# EAGLE schematic mehhhh (EAGLE 6.1)
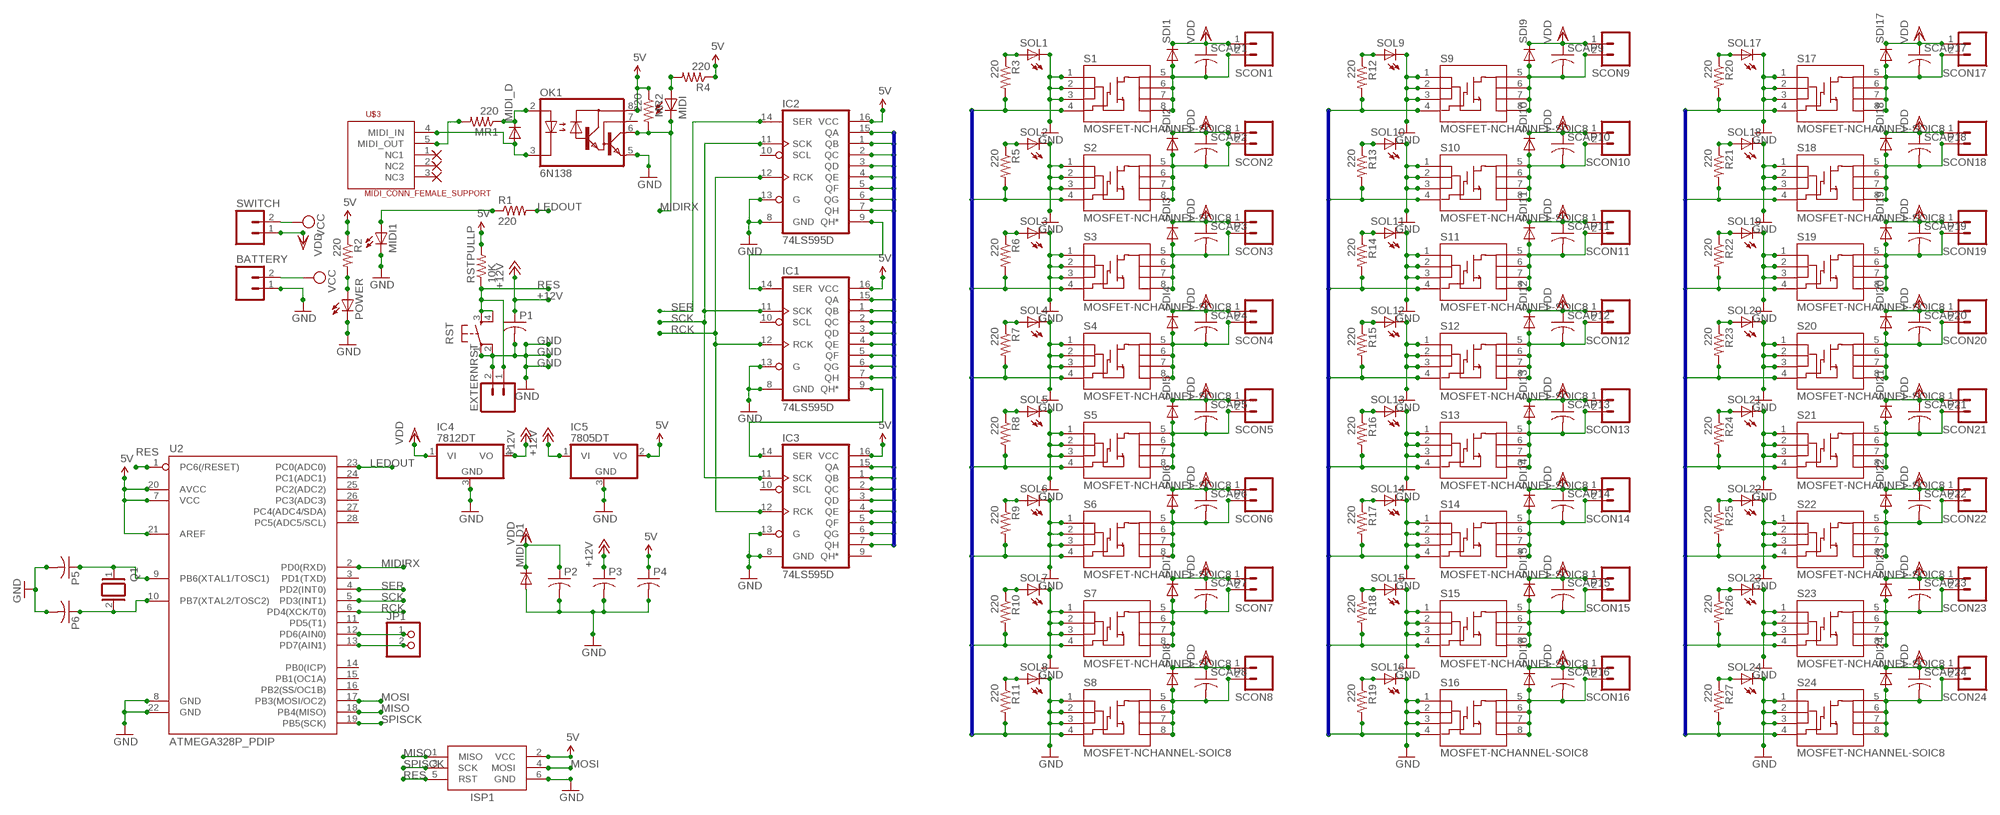
[diagram p0: schematic, sheet 1]

## Parts
BATTERY  M023.5MM  [SCREWTERMINAL-3.5MM-2]
EXTERNRST  M023.5MM  [SCREWTERMINAL-3.5MM-2]
IC1  74LS595D  [SO16]
IC2  74LS595D  [SO16]
IC3  74LS595D  [SO16]
IC4  7812DT  [TO252]
IC5  7805DT  [TO252]
ISP1  AVRISP-6  [AVRISP]
JP1  PINHD-1X2  [1X02]
MIDI  LEDCHIPLED_1206  [CHIPLED_1206]
MIDI1  LEDCHIPLED_1206  [CHIPLED_1206]
MIDI_D  DIODESMA-ALT  [SMA-DIODE_ALT]
MIDI_D1  DIODESMA-ALT  [SMA-DIODE_ALT]
MR1  220  RESISTOR1206  [1206]
MR2  220  RESISTOR1206  [1206]
OK1  6N138  [DIL08]
P1  C-USC1206  [C1206]
P2  C-USC1206  [C1206]
P3  C-USC1206  [C1206]
P4  C-USC1206  [C1206]
P5  C-USC1206  [C1206]
P6  C-USC1206  [C1206]
POWER  LEDCHIPLED_1206  [CHIPLED_1206]
Q1  XTAL/S  [QS]
R1  220  RESISTOR1206  [1206]
R2  220  RESISTOR1206  [1206]
R3  220  RESISTOR1206  [1206]
R4  220  RESISTOR1206  [1206]
R5  220  RESISTOR1206  [1206]
R6  220  RESISTOR1206  [1206]
R7  220  RESISTOR1206  [1206]
R8  220  RESISTOR1206  [1206]
R9  220  RESISTOR1206  [1206]
R10  220  RESISTOR1206  [1206]
R11  220  RESISTOR1206  [1206]
R12  220  RESISTOR1206  [1206]
R13  220  RESISTOR1206  [1206]
R14  220  RESISTOR1206  [1206]
R15  220  RESISTOR1206  [1206]
R16  220  RESISTOR1206  [1206]
R17  220  RESISTOR1206  [1206]
R18  220  RESISTOR1206  [1206]
R19  220  RESISTOR1206  [1206]
R20  220  RESISTOR1206  [1206]
R21  220  RESISTOR1206  [1206]
R22  220  RESISTOR1206  [1206]
R23  220  RESISTOR1206  [1206]
R24  220  RESISTOR1206  [1206]
R25  220  RESISTOR1206  [1206]
R26  220  RESISTOR1206  [1206]
R27  220  RESISTOR1206  [1206]
RST  TAC_SWITCHPTH  [TACTILE-PTH]
RSTPULLP  10K  RESISTOR1206  [1206]
S1  MOSFET-NCHANNEL-SOIC8  [SO08]
S2  MOSFET-NCHANNEL-SOIC8  [SO08]
S3  MOSFET-NCHANNEL-SOIC8  [SO08]
S4  MOSFET-NCHANNEL-SOIC8  [SO08]
S5  MOSFET-NCHANNEL-SOIC8  [SO08]
S6  MOSFET-NCHANNEL-SOIC8  [SO08]
S7  MOSFET-NCHANNEL-SOIC8  [SO08]
S8  MOSFET-NCHANNEL-SOIC8  [SO08]
S9  MOSFET-NCHANNEL-SOIC8  [SO08]
S10  MOSFET-NCHANNEL-SOIC8  [SO08]
S11  MOSFET-NCHANNEL-SOIC8  [SO08]
S12  MOSFET-NCHANNEL-SOIC8  [SO08]
S13  MOSFET-NCHANNEL-SOIC8  [SO08]
S14  MOSFET-NCHANNEL-SOIC8  [SO08]
S15  MOSFET-NCHANNEL-SOIC8  [SO08]
S16  MOSFET-NCHANNEL-SOIC8  [SO08]
S17  MOSFET-NCHANNEL-SOIC8  [SO08]
S18  MOSFET-NCHANNEL-SOIC8  [SO08]
S19  MOSFET-NCHANNEL-SOIC8  [SO08]
S20  MOSFET-NCHANNEL-SOIC8  [SO08]
S21  MOSFET-NCHANNEL-SOIC8  [SO08]
S22  MOSFET-NCHANNEL-SOIC8  [SO08]
S23  MOSFET-NCHANNEL-SOIC8  [SO08]
S24  MOSFET-NCHANNEL-SOIC8  [SO08]
SCAP1  C-USC1206  [C1206]
SCAP2  C-USC1206  [C1206]
SCAP3  C-USC1206  [C1206]
SCAP4  C-USC1206  [C1206]
SCAP5  C-USC1206  [C1206]
SCAP6  C-USC1206  [C1206]
SCAP7  C-USC1206  [C1206]
SCAP8  C-USC1206  [C1206]
SCAP9  C-USC1206  [C1206]
SCAP10  C-USC1206  [C1206]
SCAP11  C-USC1206  [C1206]
SCAP12  C-USC1206  [C1206]
SCAP13  C-USC1206  [C1206]
SCAP14  C-USC1206  [C1206]
SCAP15  C-USC1206  [C1206]
SCAP16  C-USC1206  [C1206]
SCAP17  C-USC1206  [C1206]
SCAP18  C-USC1206  [C1206]
SCAP19  C-USC1206  [C1206]
SCAP20  C-USC1206  [C1206]
SCAP21  C-USC1206  [C1206]
SCAP22  C-USC1206  [C1206]
SCAP23  C-USC1206  [C1206]
SCAP24  C-USC1206  [C1206]
SCON1  M023.5MM  [SCREWTERMINAL-3.5MM-2]
SCON2  M023.5MM  [SCREWTERMINAL-3.5MM-2]
SCON3  M023.5MM  [SCREWTERMINAL-3.5MM-2]
SCON4  M023.5MM  [SCREWTERMINAL-3.5MM-2]
SCON5  M023.5MM  [SCREWTERMINAL-3.5MM-2]
SCON6  M023.5MM  [SCREWTERMINAL-3.5MM-2]
SCON7  M023.5MM  [SCREWTERMINAL-3.5MM-2]
SCON8  M023.5MM  [SCREWTERMINAL-3.5MM-2]
SCON9  M023.5MM  [SCREWTERMINAL-3.5MM-2]
SCON10  M023.5MM  [SCREWTERMINAL-3.5MM-2]
SCON11  M023.5MM  [SCREWTERMINAL-3.5MM-2]
SCON12  M023.5MM  [SCREWTERMINAL-3.5MM-2]
SCON13  M023.5MM  [SCREWTERMINAL-3.5MM-2]
SCON14  M023.5MM  [SCREWTERMINAL-3.5MM-2]
SCON15  M023.5MM  [SCREWTERMINAL-3.5MM-2]
SCON16  M023.5MM  [SCREWTERMINAL-3.5MM-2]
SCON17  M023.5MM  [SCREWTERMINAL-3.5MM-2]
SCON18  M023.5MM  [SCREWTERMINAL-3.5MM-2]
SCON19  M023.5MM  [SCREWTERMINAL-3.5MM-2]
SCON20  M023.5MM  [SCREWTERMINAL-3.5MM-2]
SCON21  M023.5MM  [SCREWTERMINAL-3.5MM-2]
SCON22  M023.5MM  [SCREWTERMINAL-3.5MM-2]
SCON23  M023.5MM  [SCREWTERMINAL-3.5MM-2]
SCON24  M023.5MM  [SCREWTERMINAL-3.5MM-2]
SDI1  DIODESMA-ALT  [SMA-DIODE_ALT]
SDI2  DIODESMA-ALT  [SMA-DIODE_ALT]
SDI3  DIODESMA-ALT  [SMA-DIODE_ALT]
SDI4  DIODESMA-ALT  [SMA-DIODE_ALT]
SDI5  DIODESMA-ALT  [SMA-DIODE_ALT]
SDI6  DIODESMA-ALT  [SMA-DIODE_ALT]
SDI7  DIODESMA-ALT  [SMA-DIODE_ALT]
SDI8  DIODESMA-ALT  [SMA-DIODE_ALT]
SDI9  DIODESMA-ALT  [SMA-DIODE_ALT]
SDI10  DIODESMA-ALT  [SMA-DIODE_ALT]
SDI11  DIODESMA-ALT  [SMA-DIODE_ALT]
SDI12  DIODESMA-ALT  [SMA-DIODE_ALT]
SDI13  DIODESMA-ALT  [SMA-DIODE_ALT]
SDI14  DIODESMA-ALT  [SMA-DIODE_ALT]
SDI15  DIODESMA-ALT  [SMA-DIODE_ALT]
SDI16  DIODESMA-ALT  [SMA-DIODE_ALT]
SDI17  DIODESMA-ALT  [SMA-DIODE_ALT]
SDI18  DIODESMA-ALT  [SMA-DIODE_ALT]
SDI19  DIODESMA-ALT  [SMA-DIODE_ALT]
SDI20  DIODESMA-ALT  [SMA-DIODE_ALT]
SDI21  DIODESMA-ALT  [SMA-DIODE_ALT]
SDI22  DIODESMA-ALT  [SMA-DIODE_ALT]
SDI23  DIODESMA-ALT  [SMA-DIODE_ALT]
SDI24  DIODESMA-ALT  [SMA-DIODE_ALT]
SOL1  LEDCHIPLED_1206  [CHIPLED_1206]
SOL2  LEDCHIPLED_1206  [CHIPLED_1206]
SOL3  LEDCHIPLED_1206  [CHIPLED_1206]
SOL4  LEDCHIPLED_1206  [CHIPLED_1206]
SOL5  LEDCHIPLED_1206  [CHIPLED_1206]
SOL6  LEDCHIPLED_1206  [CHIPLED_1206]
SOL7  LEDCHIPLED_1206  [CHIPLED_1206]
SOL8  LEDCHIPLED_1206  [CHIPLED_1206]
SOL9  LEDCHIPLED_1206  [CHIPLED_1206]
SOL10  LEDCHIPLED_1206  [CHIPLED_1206]
SOL11  LEDCHIPLED_1206  [CHIPLED_1206]
SOL12  LEDCHIPLED_1206  [CHIPLED_1206]
SOL13  LEDCHIPLED_1206  [CHIPLED_1206]
SOL14  LEDCHIPLED_1206  [CHIPLED_1206]
SOL15  LEDCHIPLED_1206  [CHIPLED_1206]
SOL16  LEDCHIPLED_1206  [CHIPLED_1206]
SOL17  LEDCHIPLED_1206  [CHIPLED_1206]
SOL18  LEDCHIPLED_1206  [CHIPLED_1206]
SOL19  LEDCHIPLED_1206  [CHIPLED_1206]
SOL20  LEDCHIPLED_1206  [CHIPLED_1206]
SOL21  LEDCHIPLED_1206  [CHIPLED_1206]
SOL22  LEDCHIPLED_1206  [CHIPLED_1206]
SOL23  LEDCHIPLED_1206  [CHIPLED_1206]
SOL24  LEDCHIPLED_1206  [CHIPLED_1206]
SWITCH  M023.5MM  [SCREWTERMINAL-3.5MM-2]
U2  ATMEGA328P_PDIP  [DIL28-3]
U$3  MIDI_CONN_FEMALE_SUPPORT  [DIN_5_FEMALE_SUPPORT]

## Nets
5V: IC1.16(VCC) IC2.16(VCC) IC3.16(VCC) IC5.2(VO) ISP1.2(VCC) MR2.1 OK1.8(VCC) P4.1 R2.1 R4.1 RSTPULLP.2 U2.7(VCC) U2.20(AVCC) U2.21(AREF)
+12V: IC4.2(VO) IC5.1(VI) P1.1 P3.1
GND: BATTERY.1 EXTERNRST.2 IC1.8(GND) IC1.13(G) IC2.8(GND) IC2.13(G) IC3.8(GND) IC3.13(G) IC4.3(GND) IC5.3(GND) ISP1.6(GND) MIDI1.C MIDI_D1.A OK1.5(GND) P1.2 P2.2 P3.2 P4.2 P5.2 P6.2 POWER.C RST.1 RST.2 S1.1(S) S1.2(S) S1.3(S) S2.1(S) S2.2(S) S2.3(S) S3.1(S) S3.2(S) S3.3(S) S4.1(S) S4.2(S) S4.3(S) S5.1(S) S5.2(S) S5.3(S) S6.1(S) S6.2(S) S6.3(S) S7.1(S) S7.2(S) S7.3(S) S8.1(S) S8.2(S) S8.3(S) S9.1(S) S9.2(S) S9.3(S) S10.1(S) S10.2(S) S10.3(S) S11.1(S) S11.2(S) S11.3(S) S12.1(S) S12.2(S) S12.3(S) S13.1(S) S13.2(S) S13.3(S) S14.1(S) S14.2(S) S14.3(S) S15.1(S) S15.2(S) S15.3(S) S16.1(S) S16.2(S) S16.3(S) S17.1(S) S17.2(S) S17.3(S) S18.1(S) S18.2(S) S18.3(S) S19.1(S) S19.2(S) S19.3(S) S20.1(S) S20.2(S) S20.3(S) S21.1(S) S21.2(S) S21.3(S) S22.1(S) S22.2(S) S22.3(S) S23.1(S) S23.2(S) S23.3(S) S24.1(S) S24.2(S) S24.3(S) SOL1.C SOL2.C SOL3.C SOL4.C SOL5.C SOL6.C SOL7.C SOL8.C SOL9.C SOL10.C SOL11.C SOL12.C SOL13.C SOL14.C SOL15.C SOL16.C SOL17.C SOL18.C SOL19.C SOL20.C SOL21.C SOL22.C SOL23.C SOL24.C U2.8(GND) U2.22(GND)
LEDOUT: R1.2 U2.23(PC0(ADC0))
MIDIRX: MIDI.C MR2.2 OK1.6(VO) U2.2(PD0(RXD))
MISO: ISP1.1(MISO) U2.18(PB4(MISO))
MOSI: ISP1.4(MOSI) U2.17(PB3(MOSI/OC2))
N$1: JP1.1 U2.12(PD6(AIN0))
N$2: MR1.2 U$3.5(MIDI_OUT)
N$3: MIDI_D.C MR1.1 OK1.2(A)
N$4: MIDI_D.A OK1.3(C) U$3.4(MIDI_IN)
N$5: JP1.2 U2.13(PD7(AIN1))
N$6: MIDI1.A R1.1
N$7: POWER.A R2.2
N$8: MIDI.A R4.2
N$9: IC1.14(SER) IC2.9(QH*)
N$12: P5.1 Q1.1 U2.9(PB6(XTAL1/TOSC1))
N$13: IC1.9(QH*) IC3.14(SER)
N$14: R3.1 SOL1.A
N$15: S1.5(D) S1.6(D) S1.7(D) S1.8(D) SCAP1.2 SCON1.2 SDI1.A
N$16: S2.5(D) S2.6(D) S2.7(D) S2.8(D) SCAP2.2 SCON2.2 SDI2.A
N$17: P6.1 Q1.2 U2.10(PB7(XTAL2/TOSC2))
N$19: R5.1 SOL2.A
N$20: S3.5(D) S3.6(D) S3.7(D) S3.8(D) SCAP3.2 SCON3.2 SDI3.A
N$22: R6.1 SOL3.A
N$23: S4.5(D) S4.6(D) S4.7(D) S4.8(D) SCAP4.2 SCON4.2 SDI4.A
N$25: R7.1 SOL4.A
N$26: S5.5(D) S5.6(D) S5.7(D) S5.8(D) SCAP5.2 SCON5.2 SDI5.A
N$28: R8.1 SOL5.A
N$29: S6.5(D) S6.6(D) S6.7(D) S6.8(D) SCAP6.2 SCON6.2 SDI6.A
N$31: R9.1 SOL6.A
N$32: S7.5(D) S7.6(D) S7.7(D) S7.8(D) SCAP7.2 SCON7.2 SDI7.A
N$34: R10.1 SOL7.A
N$35: S8.5(D) S8.6(D) S8.7(D) S8.8(D) SCAP8.2 SCON8.2 SDI8.A
N$37: R11.1 SOL8.A
N$38: S9.5(D) S9.6(D) S9.7(D) S9.8(D) SCAP9.2 SCON9.2 SDI9.A
N$40: R12.1 SOL9.A
N$41: S10.5(D) S10.6(D) S10.7(D) S10.8(D) SCAP10.2 SCON10.2 SDI10.A
N$43: R13.1 SOL10.A
N$44: S11.5(D) S11.6(D) S11.7(D) S11.8(D) SCAP11.2 SCON11.2 SDI11.A
N$46: R14.1 SOL11.A
N$47: S12.5(D) S12.6(D) S12.7(D) S12.8(D) SCAP12.2 SCON12.2 SDI12.A
N$49: R15.1 SOL12.A
N$50: S13.5(D) S13.6(D) S13.7(D) S13.8(D) SCAP13.2 SCON13.2 SDI13.A
N$52: R16.1 SOL13.A
N$53: S14.5(D) S14.6(D) S14.7(D) S14.8(D) SCAP14.2 SCON14.2 SDI14.A
N$55: R17.1 SOL14.A
N$56: S15.5(D) S15.6(D) S15.7(D) S15.8(D) SCAP15.2 SCON15.2 SDI15.A
N$58: R18.1 SOL15.A
N$59: S16.5(D) S16.6(D) S16.7(D) S16.8(D) SCAP16.2 SCON16.2 SDI16.A
N$61: R19.1 SOL16.A
N$62: S17.5(D) S17.6(D) S17.7(D) S17.8(D) SCAP17.2 SCON17.2 SDI17.A
N$64: R20.1 SOL17.A
N$65: S18.5(D) S18.6(D) S18.7(D) S18.8(D) SCAP18.2 SCON18.2 SDI18.A
N$67: R21.1 SOL18.A
N$68: S19.5(D) S19.6(D) S19.7(D) S19.8(D) SCAP19.2 SCON19.2 SDI19.A
N$70: R22.1 SOL19.A
N$71: S20.5(D) S20.6(D) S20.7(D) S20.8(D) SCAP20.2 SCON20.2 SDI20.A
N$73: R23.1 SOL20.A
N$74: S21.5(D) S21.6(D) S21.7(D) S21.8(D) SCAP21.2 SCON21.2 SDI21.A
N$76: R24.1 SOL21.A
N$77: S22.5(D) S22.6(D) S22.7(D) S22.8(D) SCAP22.2 SCON22.2 SDI22.A
N$79: R25.1 SOL22.A
N$80: S23.5(D) S23.6(D) S23.7(D) S23.8(D) SCAP23.2 SCON23.2 SDI23.A
N$82: R26.1 SOL23.A
N$83: S24.5(D) S24.6(D) S24.7(D) S24.8(D) SCAP24.2 SCON24.2 SDI24.A
N$85: R27.1 SOL24.A
RCK: IC1.12(RCK) IC2.12(RCK) IC3.12(RCK) U2.6(PD4(XCK/T0))
RES: EXTERNRST.1 ISP1.5(RST) RST.3 RST.4 RSTPULLP.1 U2.1(PC6(/RESET))
SCK: IC1.11(SCK) IC2.11(SCK) IC3.11(SCK) U2.5(PD3(INT1))
SER: IC2.14(SER) U2.4(PD2(INT0))
SHIFTOUT0: IC2.15(QA) R3.2 S1.4(G)
SHIFTOUT1: IC2.1(QB) R5.2 S2.4(G)
SHIFTOUT2: IC2.2(QC) R6.2 S3.4(G)
SHIFTOUT3: IC2.3(QD) R7.2 S4.4(G)
SHIFTOUT4: IC2.4(QE) R8.2 S5.4(G)
SHIFTOUT5: IC2.5(QF) R9.2 S6.4(G)
SHIFTOUT6: IC2.6(QG) R10.2 S7.4(G)
SHIFTOUT7: IC2.7(QH) R11.2 S8.4(G)
SHIFTOUT8: IC1.15(QA) R19.2 S16.4(G)
SHIFTOUT9: IC1.1(QB) R18.2 S15.4(G)
SHIFTOUT10: IC1.2(QC) R17.2 S14.4(G)
SHIFTOUT11: IC1.3(QD) R16.2 S13.4(G)
SHIFTOUT12: IC1.4(QE) R15.2 S12.4(G)
SHIFTOUT13: IC1.5(QF) R14.2 S11.4(G)
SHIFTOUT14: IC1.6(QG) R13.2 S10.4(G)
SHIFTOUT15: IC1.7(QH) R12.2 S9.4(G)
SHIFTOUT16: IC3.15(QA) R20.2 S17.4(G)
SHIFTOUT17: IC3.1(QB) R21.2 S18.4(G)
SHIFTOUT18: IC3.2(QC) R22.2 S19.4(G)
SHIFTOUT19: IC3.3(QD) R23.2 S20.4(G)
SHIFTOUT20: IC3.4(QE) R24.2 S21.4(G)
SHIFTOUT21: IC3.5(QF) R25.2 S22.4(G)
SHIFTOUT22: IC3.6(QG) R26.2 S23.4(G)
SHIFTOUT23: IC3.7(QH) R27.2 S24.4(G)
SPISCK: ISP1.3(SCK) U2.19(PB5(SCK))
VCC: BATTERY.2 SWITCH.2
VDD: IC4.1(VI) MIDI_D1.C P2.1 SCAP1.1 SCAP2.1 SCAP3.1 SCAP4.1 SCAP5.1 SCAP6.1 SCAP7.1 SCAP8.1 SCAP9.1 SCAP10.1 SCAP11.1 SCAP12.1 SCAP13.1 SCAP14.1 SCAP15.1 SCAP16.1 SCAP17.1 SCAP18.1 SCAP19.1 SCAP20.1 SCAP21.1 SCAP22.1 SCAP23.1 SCAP24.1 SCON1.1 SCON2.1 SCON3.1 SCON4.1 SCON5.1 SCON6.1 SCON7.1 SCON8.1 SCON9.1 SCON10.1 SCON11.1 SCON12.1 SCON13.1 SCON14.1 SCON15.1 SCON16.1 SCON17.1 SCON18.1 SCON19.1 SCON20.1 SCON21.1 SCON22.1 SCON23.1 SCON24.1 SDI1.C SDI2.C SDI3.C SDI4.C SDI5.C SDI6.C SDI7.C SDI8.C SDI9.C SDI10.C SDI11.C SDI12.C SDI13.C SDI14.C SDI15.C SDI16.C SDI17.C SDI18.C SDI19.C SDI20.C SDI21.C SDI22.C SDI23.C SDI24.C SWITCH.1
Unconnected: IC1.10(SCL) IC2.10(SCL) IC3.9(QH*) IC3.10(SCL) OK1.7(VB) U2.3(PD1(TXD)) U2.11(PD5(T1)) U2.14(PB0(ICP)) U2.15(PB1(OC1A)) U2.16(PB2(SS/OC1B)) U2.24(PC1(ADC1)) U2.25(PC2(ADC2)) U2.26(PC3(ADC3)) U2.27(PC4(ADC4/SDA)) U2.28(PC5(ADC5/SCL)) U$3.1(NC1) U$3.2(NC2) U$3.3(NC3)

## Buses
SHIFTOUT[0..23]

## Library data of the parts
BATTERY EXTERNRST SCON1-SCON24 SWITCH = Due:M02: Header 2 Standard 2-pin 0.1" header. Use with straight break away headers (SKU : PRT-00116), right angle break away headers (PRT-00553), swiss pins (PRT-00743), machine pins (PRT-00117), and female headers (PRT-00115). Molex polarized connector foot print use with SKU : PRT-08233 with associated crimp pins and housings.
IC1-IC3 = Due:74*595: 8-bit SHIFT REGISTER, output latch
IC4 IC5 = linear:78*: Positive VOLTAGE REGULATOR Source: http://cache.national.com/ds/LM/LM78L05.pdf http://www.fairchildsemi.com/ds/LM/LM7805.pdf
ISP1 = adafruit:AVRISP: AVR ISP HEADER Standard 6 pin header for AVR programming
JP1 = pinhead:PINHD-1X2: PIN HEADER
MIDI MIDI1 POWER SOL1-SOL24 = adafruit:LED: LED OSRAM: - CHIPLED LG R971, LG N971, LY N971, LG Q971, LY Q971, LO R971, LY R971 LH N974, LH R974 LS Q976, LO Q976, LY Q976 LO Q996 - Hyper CHIPLED LW Q18S LB Q993, LB Q99A, LB R99A - SideLED LS A670, LO A670, LY A670, LG A670, LP A670 LB A673, LV A673, LT A673, LW A673 LH A674 LY A675 LS A676, LA A676, LO A676, LY A676, LW A676 LS A679, LY A679, LG A679 - Hyper Micro SIDELED® LS Y876, LA Y876, LO Y876, LY Y876 LT Y87S - SmartLED LW L88C, LW L88S LB L89C, LB L89S, LG L890 LS L89K, LO L89K, LY L89K LS L896, LA L896, LO L896, LY L896 - TOPLED LS T670, LO T670, LY T670, LG T670, LP T670 LSG T670, LSP T670, LSY T670, LOP T670, LYG T670 LG T671, LOG T671, LSG T671 LB T673, LV T673, LT T673, LW T673 LH T674 LS T676, LA T676, LO T676, LY T676, LB T676, LH T676, LSB T676, LW T676 LB T67C, LV T67C, LT T67C, LS T67K, LO T67K, LY T67K, LW E67C LS E67B, LA E67B, LO E67B, LY E67B, LB E67C, LV E67C, LT E67C LW T67C LS T679, LY T679, LG T679 LS T770, LO T770, LY T770, LG T770, LP T770 LB T773, LV T773, LT T773, LW T773 LH T774 LS E675, LA E675, LY E675, LS T675 LS T776, LA T776, LO T776, LY T776, LB T776 LHGB T686 LT T68C, LB T68C - Hyper Mini TOPLED® LB M676 - Mini TOPLED Santana® LG M470 LS M47K, LO M47K, LY M47K Source: http://www.osram.convergy.de/
MIDI_D MIDI_D1 SDI1-SDI24 = Due:DIODE: Diode These are standard reverse protection diodes and small signal diodes. SMA package can handle up to about 1A. SOD-323 can handle about 200mA. What the SOD-323 package when ordering, there are some mfgs out there that are 5-pin packages.
MR1 MR2 R1-R27 RSTPULLP = Due:RESISTOR: Resistor Basic schematic elements and footprints for 0603, 1206, and PTH resistors.
OK1 = optocoupler:6N138: MOTOROLA OPTO COUPLER
P1-P6 SCAP1-SCAP24 = adafruit:C-US: CAPACITOR, American symbol
Q1 = special:XTAL/S: CRYSTAL
RST = SparkFun:TAC_SWITCH: Momentary Switch Button commonly used for reset or general input. Spark Fun Electronics SKU : COM-00097
S1-S24 = SparkFun:MOSFET-NCHANNEL-SOIC8: N-Channel MOSFET IRF9410 and NDS8434 are common, SOIC-8 parts.
U2 = SparkFun-DigitalIC:ATMEGA328P_PDIP: uC used in the Arduino 32kb flash, 1k EEPROM, 2k SRAM This is the through-hole version of this chip.
U$3 = SparkFun-Connectors:MIDI_CONN_FEMALE_SUPPORT: MIDI connector with strain relief (DIN-5 female)